# Altium schematic sheet INA288.SchDoc
size A
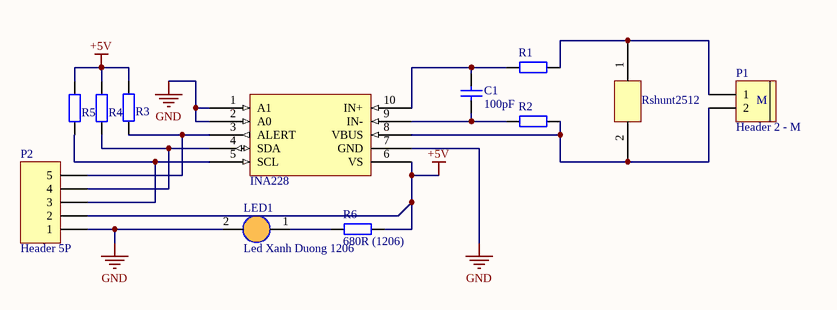
[diagram p0: INA288.SchDoc]

## Parts
C1  100pF  [tu 1206]
INA1  INA228  [INA228]
LED1  Led Xanh Duong 1206  [led 1206]
P1  Header 2 - M  [Medium - Header 2]
P2  Header 5P  [HDR1X5]
R1  1R (1206)  [TRO 1206]  (value not drawn)
R2  1R (1206)  [TRO 1206]  (value not drawn)
R3  10k (1206-1%)  [TRO 1206]  (value not drawn)
R4  10k (1206-1%)  [TRO 1206]  (value not drawn)
R5  10k (1206-1%)  [TRO 1206]  (value not drawn)
R6  680R (1206)  [TRO 1206]
Rshunt1  Rshunt2512  [Rshunt2512]

## Nets
+5V: INA1.6(VS) P2.2 R3.1 R4.2 R5.2 R6.2
GND: INA1.1(A1) INA1.2(A0) INA1.7(GND) LED1.2(K) P2.1
NetC1_1: C1.1 INA1.10(IN+) R1.1
NetC1_2: C1.2 INA1.9(IN-) R2.1
NetINA1_3: INA1.3(ALERT) P2.5 R3.2
NetINA1_4: INA1.4(SDA) P2.4 R4.1
NetINA1_5: INA1.5(SCL) P2.3 R5.1
NetINA1_8: INA1.8(VBUS) P1.2 R2.2 Rshunt1.2
NetLED1_1: LED1.1(A) R6.1
NetP1_1: P1.1 R1.2 Rshunt1.1

## Notes on the sheet
- (in symbol Header 2 - M) M

## Library data of the parts
C1 = Tu 1206 100pF 50V 5%: Dán; Don_Vi: Con; So_Chan: 2; Ten_Linh_Kien: Tụ 1206 100P 5% 50V; Ma_Hang: MH008101; Chung_Loai: Dán; Kieu_Chan: *
LED1 = Led 1206 Xanh Duong: Dán; Kieu_Chan: 1206; Ma_Hang: MH002333; Ten_Linh_Kien: LED 1206 Màu Xanh Dương (Blue); Don_Vi: Con; So_Chan: 2; Chung_Loai: Dán
P1 = Header 2 - M: Header, 2-Pin, Medium; LatestRevisionDate: 17-Jul-2002; LatestRevisionNote: Re-released for DXP Platform.; Publisher: Altium Limited
P2 = Header 5x1: Header, 5 Pin Pitch 2.54mm; MPN: S1012EC-40-ND; CompanyID: VT-00125; Solder: WAVE; Value: Header 5P
R1 R2 = Tro 1206 5% 1R: Dán; Don_Vi: Con; So_Chan: 2; Ten_Linh_Kien: Trở 1206 5% 1R; Ma_Hang: MH005905; Chung_Loai: Dán; Kieu_Chan: *
R3-R5 = Tro 1206 1% 10k: Dán; Don_Vi: Con; So_Chan: 2; Ten_Linh_Kien: Trở 1206 1% 10k; Ma_Hang: MH005885; Chung_Loai: Dán; Kieu_Chan: *
R6 = Tro 1206 5% 680R: Dán; Don_Vi: Con; So_Chan: 2; Ten_Linh_Kien: Trở 1206 5% 680R; Ma_Hang: MH005928; Chung_Loai: Dán; Kieu_Chan: *